# Altium schematic sheet stm32.SchDoc
size A3
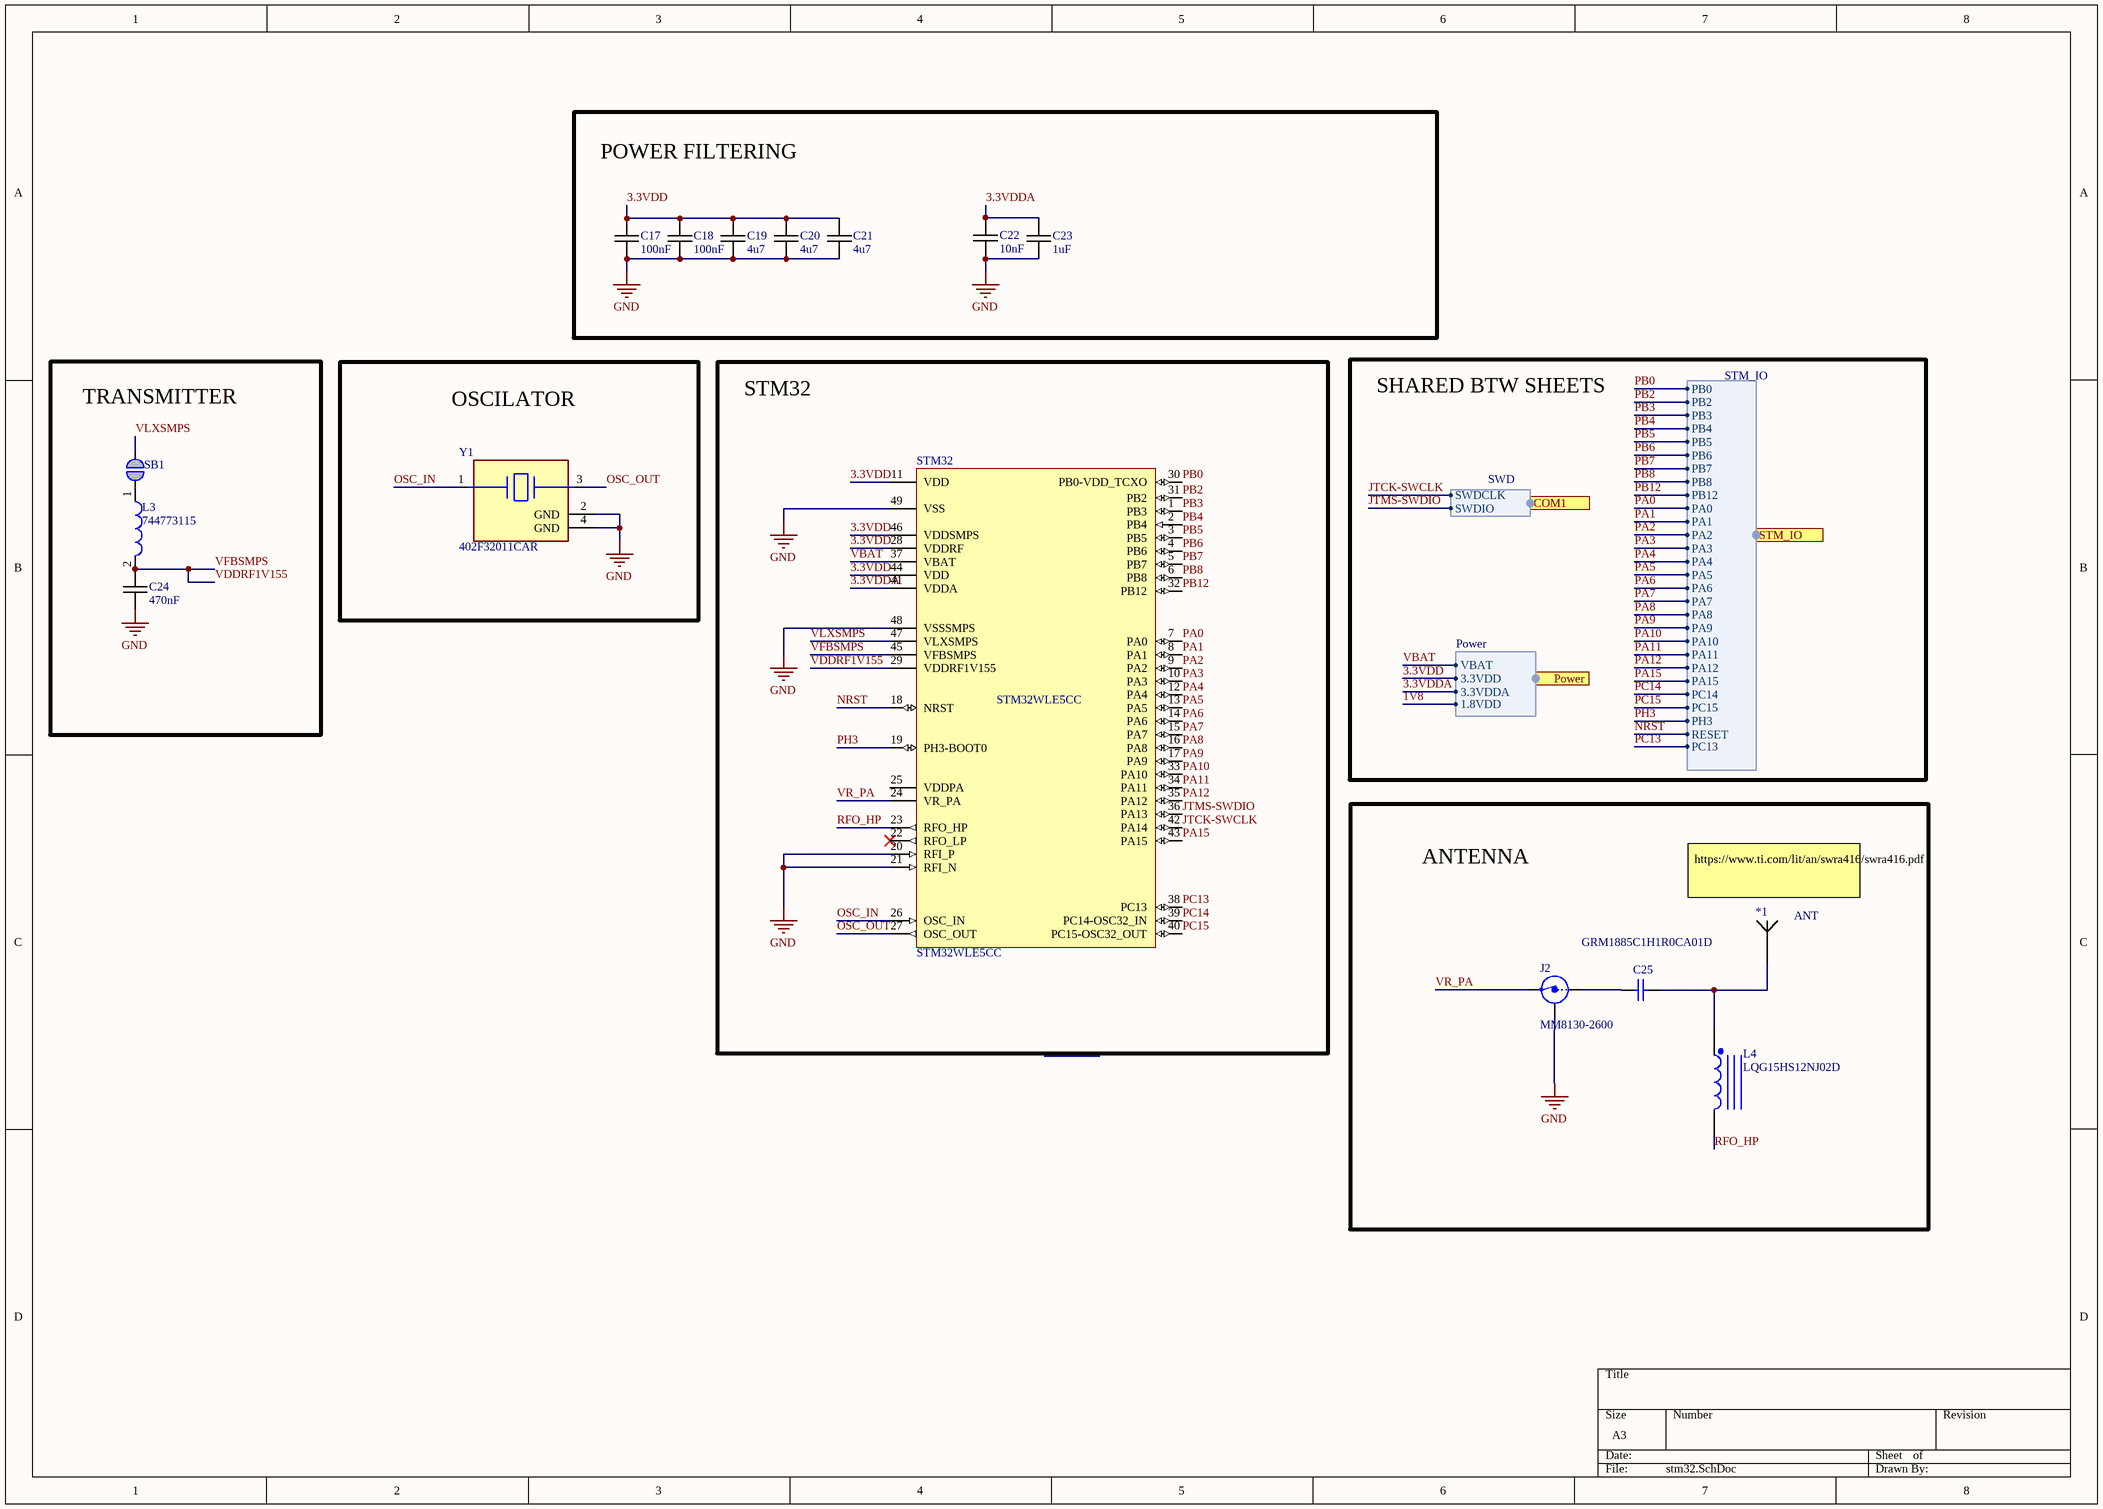
[diagram p0: stm32.SchDoc]

## Parts
*1  ANT
C17  100nF  [0603C-GENERIC]
C18  100nF  [0603C-GENERIC]
C19  4u7  [0603C-GENERIC]
C20  4u7  [0603C-GENERIC]
C21  4u7  [0603C-GENERIC]
C22  10nF  [0603C-GENERIC]
C23  1uF  [0603C-GENERIC]
C24  470nF  [0603C-GENERIC]
C25  GRM1885C1H1R0CA01D  [CAPC1608X90X35NL10T15]
J2  MM8130-2600  [COAXIAL-SWF]
L3  744773115  [WE-PD2-S]
L4  LQG15HS12NJ02D  [INDC1005X55X25LL05T10_A]
SB1  Solderbridge  [Solderbridge]  (value not drawn)  (no BOM)
STM32  STM32WLE5CC  [stm32wle5cc]
Y1  402F32011CAR  [FP-402-MFG]

## Blocks framed on the sheet
POWER FILTERING: C17-C23
TRANSMITTER: C24 L3 SB1
OSCILATOR: Y1
STM32: STM32
ANTENNA: *1 C25 J2 L4

## Ports
COM1 (harness SWD), Power (harness Power), STM_IO (harness STM_IO)

## Harnesses
STM_IO: PB2, PB3, PB4, PB5, PB6, PB7, PB8, PB12, PA0, PA1, PA2, PA3, PA4, PA5, PA6, PA7, PA8, PA9, PA10, PA11, PA12, PA15, PC14, PC15, PB0, PH3, RESET, PC13
SWD: SWDCLK, SWDIO
Power: VBAT, 3.3VDD, 3.3VDDA, 1.8VDD

## Nets
GND: C17.2 C18.2 C19.2 C20.2 C21.2 C22.2 C23.2 C24.2 J2.2(Shield) STM32.20(RFI_P) STM32.21(RFI_N) STM32.48(VSSSMPS) STM32.49(VSS) Y1.2(GND) Y1.4(GND)
1V8: port Power.1.8VDD
3.3VDD: C17.1 C18.1 C19.1 C20.1 C21.1 STM32.11(VDD) STM32.28(VDDRF) STM32.44(VDD) STM32.46(VDDSMPS) ; port Power.3.3VDD
3.3VDDA: C22.1 C23.1 STM32.41(VDDA) ; port Power.3.3VDDA
JTCK-SWCLK: STM32.42(PA14) ; port COM1.SWDCLK
JTMS-SWDIO: STM32.36(PA13) ; port COM1.SWDIO
NRST: STM32.18(NRST) ; port STM_IO.RESET
OSC_IN: STM32.26(OSC_IN) Y1.1
OSC_OUT: STM32.27(OSC_OUT) Y1.3
PA0: STM32.7(PA0) ; port STM_IO.PA0
PA1: STM32.8(PA1) ; port STM_IO.PA1
PA2: STM32.9(PA2) ; port STM_IO.PA2
PA3: STM32.10(PA3) ; port STM_IO.PA3
PA4: STM32.12(PA4) ; port STM_IO.PA4
PA5: STM32.13(PA5) ; port STM_IO.PA5
PA6: STM32.14(PA6) ; port STM_IO.PA6
PA7: STM32.15(PA7) ; port STM_IO.PA7
PA8: STM32.16(PA8) ; port STM_IO.PA8
PA9: STM32.17(PA9) ; port STM_IO.PA9
PA10: STM32.33(PA10) ; port STM_IO.PA10
PA11: STM32.34(PA11) ; port STM_IO.PA11
PA12: STM32.35(PA12) ; port STM_IO.PA12
PA15: STM32.43(PA15) ; port STM_IO.PA15
PB0: STM32.30(PB0-VDD_TCXO) ; port STM_IO.PB0
PB2: STM32.31(PB2) ; port STM_IO.PB2
PB3: STM32.1(PB3) ; port STM_IO.PB3
PB4: STM32.2(PB4) ; port STM_IO.PB4
PB5: STM32.3(PB5) ; port STM_IO.PB5
PB6: STM32.4(PB6) ; port STM_IO.PB6
PB7: STM32.5(PB7) ; port STM_IO.PB7
PB8: STM32.6(PB8) ; port STM_IO.PB8
PB12: STM32.32(PB12) ; port STM_IO.PB12
PC13: STM32.38(PC13) ; port STM_IO.PC13
PC14: STM32.39(PC14-OSC32_IN) ; port STM_IO.PC14
PC15: STM32.40(PC15-OSC32_OUT) ; port STM_IO.PC15
PH3: STM32.19(PH3-BOOT0) ; port STM_IO.PH3
RFO_HP: L4.2 STM32.23(RFO_HP)
VBAT: STM32.37(VBAT) ; port Power.VBAT
VDDRF1V155: C24.1 L3.2 STM32.29(VDDRF1V155) STM32.45(VFBSMPS)  [also labelled VFBSMPS]
VLXSMPS: SB1.1 STM32.47(VLXSMPS)
VR_PA: J2.3(OUT) STM32.24(VR_PA)
Net*1_1: *1.1 C25.2 L4.1
NetC25_1: C25.1 J2.1(IN)
NetL3_1: L3.1 SB1.2

Not connected (* = marked no-connect by the designer): STM32 22(RFO_LP)* 25(VDDPA)

## Notes on the sheet
- SHARED BTW SHEETS
- https://www.ti.com/lit/an/swra416/swra416.pdf

## Library data of the parts
C17 C18 = 0603C-100NF-50V-X7R-TDK: CAPACITOR 0603 CERAMIC; Manufacturer Part Number: C1608X7R1H103K; Manufacturer: TDK Corporation; Temperature Coefficient: X7R; Tolerance: ±10%; Voltage - Rated: 50V; Capacitance: 10000pF; Reel: C68; RoHS: RoHS Compliant; Lead Spacing: -; Package / Case: 0603 (1608 metric); Features: General Purpose; Packaging: Tape & Reel (TR); Thickness: 0.80mm; Operating Temperature: -55°C ~ 125°C; Mounting Type: Surface Mount, MLCC; Category: Capacitors; Supplier 1: Digi-Key; Supplier Part Number 1: 445-1314-2-ND
C19-C21 = 0603C-4U7-6V3-X5R-KEM: CAPACITOR 0603 CERAMIC; Reel: C36
C22 = 0603C-10NF-50V-X7R-MUR: CAPACITOR 0603 CERAMIC; Manufacturer Part Number: GRM188R71H103KA01D; Manufacturer: Murata Electronics North America; Reel: C22; Supplier 1: Digi-Key; Supplier Part Number 1: 490-1512-2-ND
C23 = 0603C-1UF-25V-X5R-SAM: CAPACITOR 0603 CERAMIC; Reel: C17
C24 = 0603C-470NF-25V-X7R-MUR: CAPACITOR 0603 CERAMIC; Manufacturer: Murata Electronics North America; Manufacturer Part Number: GRM188R71E474KA12D; Reel: C14; Temperature Coefficient: X7R; Capacitance: 0.47µF; Voltage - Rated: 25V; Tolerance: ±10%; Supplier 1: Digi-Key; RoHS: RoHS Compliant; Features: General Purpose; Operating Temperature: -55°C ~ 125°C; Packaging: Tape & Reel (TR); Thickness: 0.80mm; Mounting Type: Surface Mount, MLCC; Lead Spacing: -; Category: Capacitors; Package / Case: 0603 (1608 metric); Supplier: Digi-Key; Supplier Part Number 1: 490-3291-2-ND; Supplier Part Number: 490-3291-2-ND
C25 = CMP-2006-02464-1: Manufacturer: Murata; Part Number: GRM1885C1H1R0CA01D
J2 = MM8130-2600: Coaxial Connector with Switch; Manufacturer: Murata; Part number IPS: 00000009955; Artikkelnr Noca: 55029011; Part Number: MM8130-2600; Manufacturer Part Number: MM8130-2600; LatestRevisionDate: 2014-04-24; Pin Count: 3; Publisher: Nordic Semiconductor; Published: 2014-04-24; Value: MM8130-2600; Note: *; Footprint Doc: COAXIAL-SWF; ComponentLink1URL: *; ComponentLink1Description: Datasheet; ComponentLink2URL: *; ComponentLink2Description: Supplier link; HelpURL: http://www.murata.com/products/catalog/pdf/o33e.pdf; Supplier 1: Digi-Key; Supplier Part Number 1: 490-4981-1-ND; Supplier 2: Mouser; Supplier Part Number 2: 81-MM8130-2600RA2
L3 = CMP-0227-00515-1: SMD Power Inductor WE-PD2, L = 15.0 µH; Inductance: 15.0 ÂµH; PackageDescription: SMD Inductor, 2-Leads, Body 4.5 x 4.0 mm; PackageVersion: 2004; ComponentLink1Description: Manufacturer Link; ComponentLink2Description: Datasheet; PackageReference: WE-PD2-S; ComponentLink2URL: http://www.we-online.de/katalog/media/pdf/744773115.pdf; ComponentLink1URL: http://www.we-online.com; DatasheetVersion: ver 1, Oct-2004
L4 = CMP-2000-06576-1: Chip Inductor, 12 nH, +/-5%, 300 mA, -55 to 125 degC, 0402 (1005 Metric), RoHS, Tape and Reel; Manufacturer: Murata; Inductance-Nom: 12nH; Rated Current-Max: 300mA; Tolerance (%): ±5%; DC Resistance: 0.28O; Datasheet Version: 09/2010; Manufacturer URL: http://www.murata.com/; Package Reference: 0402; Case Size/Dimension: 0402; Datasheet URL: http://search.murata.co.jp/Ceramy/image/img/PDF/ENG/L0075S0083LQG15HS.pdf; Mounting Technology: SurfaceMount; Package Description: 2-Pin Surface Mount Device, Body 1 x 0.5 mm
SB1 = SOLDERBRIDGE: Artikkelnr Noca: N.A.; Part Number: Solderbridge; Manufacturer: *; Manufacturer Part Number: *; ComponentLink1URL: *; ComponentLink1Description: Datasheet; ComponentLink2URL: *; ComponentLink2Description: Supplier link; HelpURL: *; Footprint Doc: Solderbridge; LatestRevisionDate: 2009-12-14; Pin Count: 2; Publisher: Nordic Semiconductor; Published: 2009-12-14; Value: Solderbridge; Note: *; Supplier 1: *; Supplier Part Number 1: *; Supplier 2: *; Supplier Part Number 2: *; Part number IPS: N.A.
STM32 = STM32WLE5CC: Ultra-low power multi-modulation wireless STM32WLE5 microcontrollers
Y1 = CMP-06858-000005-1: CRYSTAL 32.0000MHZ 10PF SMD; Frequency Tolerance: 10ppm; Frequency: 32MHz; Series Resistance: 100R; Width: 0.063inch; Height: 0.022inch; Length: 0.079inch; Contact Plating: Gold; Package Quantity: 3000; Case/Package: SMD/SMT; Frequency Stability: 10ppm; ESR (Equivalent Series Resistance): 100R; Min Operating Temperature: -20°C; Tolerance: 10ppm; Load Capacitance: 10pF; Packaging: Tape and Reel; Max Operating Temperature: 70°C; Mount: Surface Mount; Termination: SMD/SMT